# Altium schematic sheet SpotLight.SchDoc
size A4
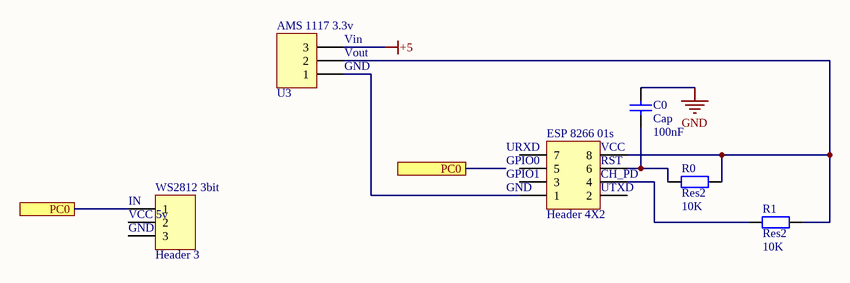
[diagram p0: SpotLight.SchDoc]

## Parts
AMS_1117_3.3v  U3  [HDR1X3]
C0  Cap  value 100nF  [RAD-0.3]
ESP_8266_01s  Header 4X2  [HDR2X4]
R0  Res2  value 10K  [AXIAL-0.4]
R1  Res2  value 10K  [AXIAL-0.4]
WS2812_3bit  Header 3  [HDR1X3]

## Ports
PC0

## Nets
+5: AMS_1117_3.3v.3
GND: C0.2
PC0: WS2812_3bit.1 ; port PC0
NetAMS_1117_3.3v_1: AMS_1117_3.3v.1 ESP_8266_01s.1
NetAMS_1117_3.3v_2: AMS_1117_3.3v.2 ESP_8266_01s.8 R0.1 R1.1
NetC0_1: C0.1 ESP_8266_01s.6 R0.2
NetESP_8266_01s_4: ESP_8266_01s.4 R1.2

Not connected (* = marked no-connect by the designer): ESP_8266_01s 2 3 5 7; WS2812_3bit 2 3

## Notes on the sheet
- (near AMS_1117_3.3v) Vout
- (near AMS_1117_3.3v) Vin
- (near AMS_1117_3.3v) GND
- (near ESP_8266_01s) GND
- (near ESP_8266_01s) GPIO1
- (near ESP_8266_01s) GPIO0
- (near ESP_8266_01s) URXD
- (near ESP_8266_01s) UTXD
- (near ESP_8266_01s) CH_PD
- (near ESP_8266_01s) RST
- (near ESP_8266_01s) VCC
- (near WS2812_3bit) GND
- (near WS2812_3bit) VCC 5v
- (near WS2812_3bit) IN

## Library data of the parts
AMS_1117_3.3v WS2812_3bit = Header 3: Header, 3-Pin; LatestRevisionDate: 17-Jul-2002; LatestRevisionNote: Re-released for DXP Platform.; Publisher: Altium Limited
C0 = Cap: Capacitor; Published: 8-Jun-2000; LatestRevisionDate: 17-Jul-2002; LatestRevisionNote: Re-released for DXP Platform.; PackageReference: RAD-0.3; Publisher: Altium Limited; PackageDescription: Radial Cap, Thru-Hole; 2 Leads; 0.3 in Pin Spacing
ESP_8266_01s = Header 4X2: Header, 4-Pin, Dual row; LatestRevisionDate: 17-Jul-2002; LatestRevisionNote: Re-released for DXP Platform.; Publisher: Altium Limited
R0 R1 = Res2: Resistor; Published: 8-Jun-2000; LatestRevisionDate: 17-Jul-2002; LatestRevisionNote: Re-released for DXP Platform.; PackageReference: AXIAL-0.4; Publisher: Altium Limited; PackageDescription: Axial Device, Thru-Hole; 2 Leads; 0.4 in Pin Spacing